# Altium project 001_TL491_3_BMS.PrjPcb
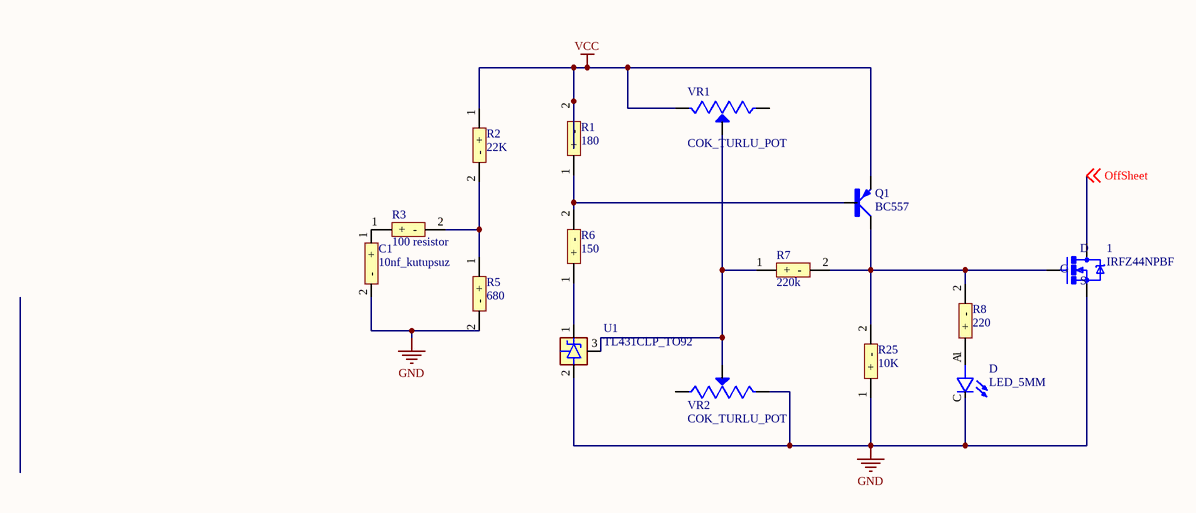
[diagram p0: TL431.SchDoc]
5 sheets, 62 parts. Net scope: global (net labels, ports and power ports of the same name join across sheets).
Board files: PCB1.PcbDoc, 001_20.07.21.PcbDoc, 002_12_08_21.PcbDoc
Sheets:
  TL431.SchDoc
  gerilim_okuma.SchDoc
  hücre_gerilim_okuma.SchDoc
  LM35.SchDoc
  devre.SchDoc

## Sheet TL431.SchDoc
size A4

### Parts
(Parts that share a designator on the sheet are numbered #1, #2 ... from top to bottom, then left to right.)
1  IRFZ44NPBF  [IRFZ44N]
C1  10nf_kutupsuz  [10NF_KUTUPSUZ]
D  LED_5MM  [LED_5MM]
Q1  BC557  [BC557]
R1#1  180  [100 resistor]
R2  22K  [100 resistor]
R3  100 resistor  [100 resistor]
R5  680  [100 resistor]
R6  150  [100 resistor]
R7  220k  [100 resistor]
R8  220  [100 resistor]
R25  10K  [100 resistor]
U1  TL431CLP_TO92  [TL432_TO92]
VR1  COK_TURLU_POT  [COK_TURLU_POT]
VR2  COK_TURLU_POT  [COK_TURLU_POT]

### Nets
GND: 1.3(S) C1.2(-) D.C R5.2(-) R25.1(+) U1.2(ANODE) VR2.3(CW)
VCC: Q1.E R1#1.2(-) R2.1(+) VR1.3(CW)
OffSheet: 1.2(D) ; off-sheet OffSheet
Net1_1: 1.1(G) Q1.C R7.2(-) R8.2(-) R25.2(-)
NetC1_1: C1.1(+) R3.1(+)
NetD_A: D.A R8.1(+)
NetQ1_B: Q1.B R1#1.1(+) R6.2(-)
NetR2_2: R2.2(-) R3.2(-) R5.1(+)
NetR6_1: R6.1(+) U1.1(CATHODE)
NetR7_1: R7.1(+) U1.3(REF) VR1.2(WIPER) VR2.2(WIPER)

Not connected (* = marked no-connect by the designer): VR1 1(CCW); VR2 1(CCW)

### Library data of the parts
1 = IRFZ44NPBF: RoHS Compliant | Low RDS_on_ | Industry-leading quality | Dynamic dv/dt Rating | Fast Switching | Fully Avalanche Rated | 175C Operating Temperature; MF: Infineon; MP: IRFZ44NPBF; Price: None; SnapEDA_Link: https://www.snapeda.com/parts/IRFZ44NPBF/Infineon%20Technologies/view-part/1662576/?ref=snap; Package: TO-220 Infineon; Value: *; Availability: Unavailable
D = LED_5MM: LED; 5mm; green; 5-32mcd; 60Â°; Front: convex; MF: Kingbright; MP: L-53GD; Availability: Unavailable; SnapEDA_Link: https://www.snapeda.com/parts/L-53GD/Kingbright/view-part/525636/?ref=snap; Price: None; Package: CDIP-28 Kingbright; Value: *
Q1 = BC557: Bipolar _BJT_ Transistor PNP 45V 100mA 150MHz 500mW Through Hole TO-92-3; MF: ON; MP: BC557; Price: None; SnapEDA_Link: https://www.snapeda.com/parts/BC557/ON%20Semiconductor/view-part/681642/?ref=snap; Package: TO-92 Rochester Electronics; Value: *; Availability: Unavailable
R1#1 R2 R5-R8 R25 = 100 resistor
U1 = TL431CLP_TO92: Adjustable precision shunt regulator 3-TO-92 0 to 70; MF: Texas Instruments; Purchase-URL: https://pricing.snapeda.com/search/part/TL431CLP/?ref=eda; Price: None; Package: TO-92 Texas Instruments; Check_prices: https://www.snapeda.com/parts/TL431CLP/Texas%20Instruments/view-part/4478972/?ref=eda; Value: *; MP: TL431CLP; Availability: Good; SnapEDA_Link: https://www.snapeda.com/parts/TL431CLP/Texas%20Instruments/view-part/4478972/?ref=snap
VR1 VR2 = COK_TURLU_POT: 30 kOhms 0.5W, 1/2W PC Pins Through Hole Trimmer Potentiometer Cermet 25 Turn Top Adjustment; MP: 3296W-1-303; MF: Bourns; Check_prices: https://www.snapeda.com/parts/3296W-1-303/Bourns/view-part/1485011/?ref=eda; Value: *; Availability: Unavailable; Price: None; Package: SOT-23-5 Bourns; SnapEDA_Link: https://www.snapeda.com/parts/3296W-1-303/Bourns/view-part/1485011/?ref=snap

## Sheet gerilim_okuma.SchDoc
size A4
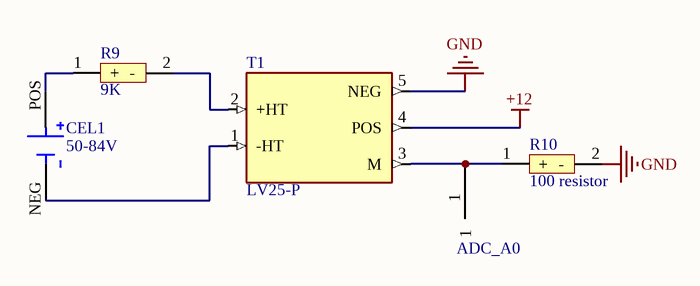
[diagram p1: gerilim_okuma.SchDoc]

### Parts
(Parts that share a designator on the sheet are numbered #1, #2 ... from top to bottom, then left to right.)
CEL1#1  50-84V  [BAT_BA2AAPC-UL94V-0]
P2  ADC_A0  [1pinheader]
R9  9K  [100 resistor]
R10  100 resistor  [100 resistor]
T1  LV25-P  [XDCR_LV25-P]

### Nets
+12: T1.4(POS)
GND: R10.2(-) T1.5(NEG)
NetCEL1#1_NEG: CEL1#1.NEG T1.1(-HT)
NetCEL1#1_POS: CEL1#1.POS R9.1(+)
NetP2_1: P2.1 R10.1(+) T1.3(M)
NetR9_2: R9.2(-) T1.2(+HT)

### Library data of the parts
CEL1#1 = CELL: BATTERY HOLDER AA 2 CELL SMD TAB; MF: MPD; MP: BA2AAPC-UL94V-0; Value: *; Price: None; Package: None; Check_prices: https://www.snapeda.com/parts/BA2AAPC-UL94V-0/MPD/view-part/4389111/?ref=eda; Availability: Warning; SnapEDA_Link: https://www.snapeda.com/parts/BA2AAPC-UL94V-0/MPD/view-part/4389111/?ref=snap; Purchase-URL: https://pricing.snapeda.com/search/part/BA2AAPC-UL94V-0/?ref=eda
P2 = 1 pin header
R9 = 100 resistor
T1 = LV25-P: Voltage, Closed Loop Sensor Voltage Output; MF: LEM USA Inc.; SnapEDA_Link: https://www.snapeda.com/parts/LV%2025-P/LEM%20USA%20Inc./view-part/5138977/?ref=snap; Digi-Key_Part_Number: 398-1019-ND; Value: *; Check_prices: https://www.snapeda.com/parts/LV%2025-P/LEM%20USA%20Inc./view-part/5138977/?ref=eda; MP: LV 25-P; Package: None

## Sheet hücre_gerilim_okuma.SchDoc
size A4
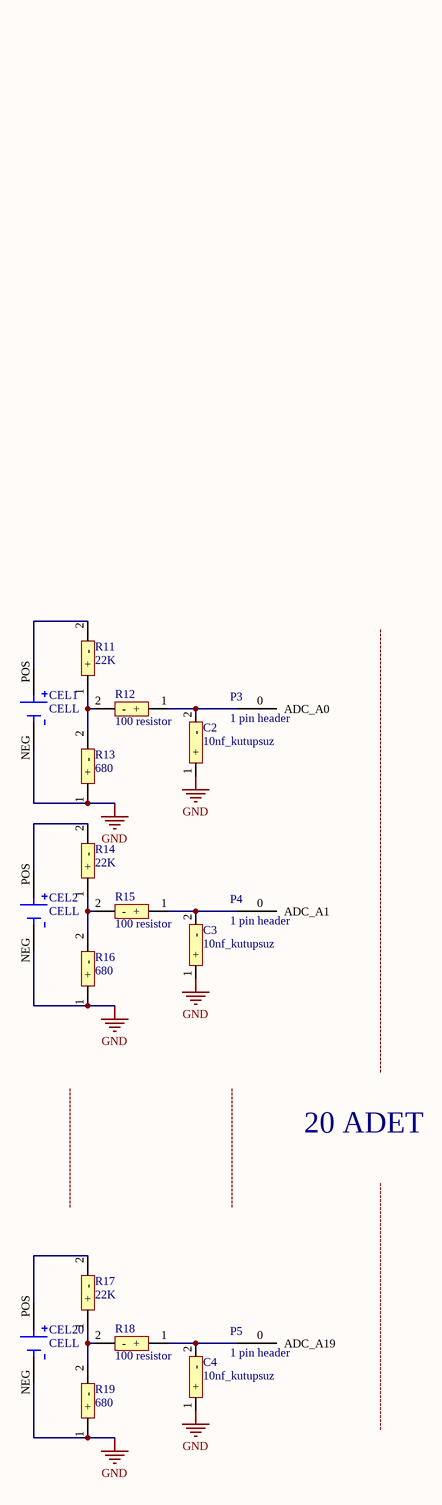
[diagram p2: hücre_gerilim_okuma.SchDoc]

### Parts
(Parts that share a designator on the sheet are numbered #1, #2 ... from top to bottom, then left to right.)
C2  10nf_kutupsuz  [10NF_KUTUPSUZ]
C3  10nf_kutupsuz  [10NF_KUTUPSUZ]
C4  10nf_kutupsuz  [10NF_KUTUPSUZ]
CEL1#2  CELL  [BAT_BA2AAPC-UL94V-0]
CEL2  CELL  [BAT_BA2AAPC-UL94V-0]
CEL20  CELL  [BAT_BA2AAPC-UL94V-0]
P3  1 pin header  [1pinheader]
P4  1 pin header  [1pinheader]
P5  1 pin header  [1pinheader]
R11  22K  [100 resistor]
R12  100 resistor  [100 resistor]
R13  680  [100 resistor]
R14  22K  [100 resistor]
R15  100 resistor  [100 resistor]
R16  680  [100 resistor]
R17  22K  [100 resistor]
R18  100 resistor  [100 resistor]
R19  680  [100 resistor]

### Nets
GND: C2.1(+) C3.1(+) C4.1(+) CEL1#2.NEG CEL2.NEG CEL20.NEG R13.1(+) R16.1(+) R19.1(+)
NetC2_2: C2.2(-) P3.0(ADC_A0) R12.1(+)
NetC3_2: C3.2(-) P4.0(ADC_A1) R15.1(+)
NetC4_2: C4.2(-) P5.0(ADC_A19) R18.1(+)
NetCEL1#2_POS: CEL1#2.POS R11.2(-)
NetCEL2_POS: CEL2.POS R14.2(-)
NetCEL20_POS: CEL20.POS R17.2(-)
NetR11_1: R11.1(+) R12.2(-) R13.2(-)
NetR14_1: R14.1(+) R15.2(-) R16.2(-)
NetR17_1: R17.1(+) R18.2(-) R19.2(-)

### Notes on the sheet
- 20 ADET
- Labels drawn without touching a wire or pin: ------------------------------, --------------------------------------------------------------, ---------------------------------------------------------------------------------------------------------------

### Library data of the parts
CEL1#2 CEL2 CEL20 = CELL: as CEL1#1 on sheet gerilim_okuma; Value: *; Price: None; Package: None; Check_prices: https://www.snapeda.com/parts/BA2AAPC-UL94V-0/MPD/view-part/4389111/?ref=eda; Availability: Warning; SnapEDA_Link: https://www.snapeda.com/parts/BA2AAPC-UL94V-0/MPD/view-part/4389111/?ref=snap; Purchase-URL: https://pricing.snapeda.com/search/part/BA2AAPC-UL94V-0/?ref=eda
R11 R13 R14 R16 R17 R19 = 100 resistor

## Sheet LM35.SchDoc
size A4
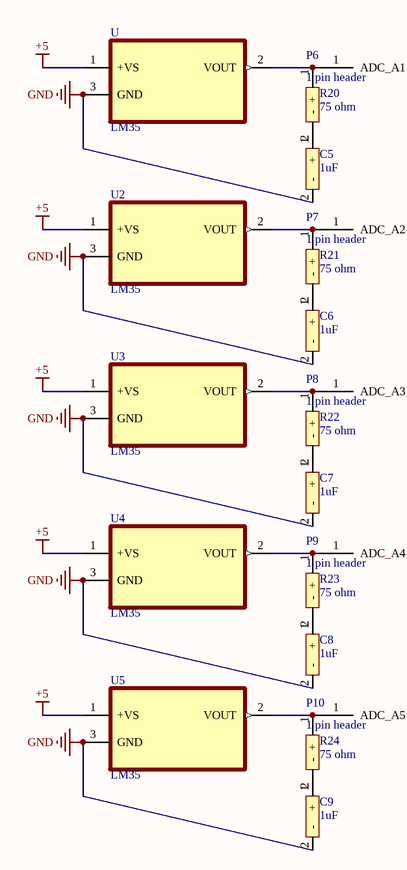
[diagram p3: LM35.SchDoc]

### Parts
C5  1uF  [10NF_KUTUPSUZ]
C6  1uF  [10NF_KUTUPSUZ]
C7  1uF  [10NF_KUTUPSUZ]
C8  1uF  [10NF_KUTUPSUZ]
C9  1uF  [10NF_KUTUPSUZ]
P6  1 pin header  [1pinheader]
P7  1 pin header  [1pinheader]
P8  1 pin header  [1pinheader]
P9  1 pin header  [1pinheader]
P10  1 pin header  [1pinheader]
R20  75 ohm  [100 resistor]
R21  75 ohm  [100 resistor]
R22  75 ohm  [100 resistor]
R23  75 ohm  [100 resistor]
R24  75 ohm  [100 resistor]
U  LM35  [TO127P254X495-3P]
U2  LM35  [TO127P254X495-3P]
U3  LM35  [TO127P254X495-3P]
U4  LM35  [TO127P254X495-3P]
U5  LM35  [TO127P254X495-3P]

### Nets
+5: U.1(+VS) U2.1(+VS) U3.1(+VS) U4.1(+VS) U5.1(+VS)
GND: C5.2(-) C6.2(-) C7.2(-) C8.2(-) C9.2(-) U.3(GND) U2.3(GND) U3.3(GND) U4.3(GND) U5.3(GND)
NetP6_1: P6.1(ADC_A1) R20.1(+) U.2(VOUT)
NetP7_1: P7.1(ADC_A2) R21.1(+) U2.2(VOUT)
NetP8_1: P8.1(ADC_A3) R22.1(+) U3.2(VOUT)
NetP9_1: P9.1(ADC_A4) R23.1(+) U4.2(VOUT)
NetP10_1: P10.1(ADC_A5) R24.1(+) U5.2(VOUT)

Not connected (* = marked no-connect by the designer): C5 1(+); C6 1(+); C7 1(+); C8 1(+); C9 1(+); R20 2(-); R21 2(-); R22 2(-); R23 2(-); R24 2(-)

### Library data of the parts
C5-C9 = 10nf_kutupsuz
R20-R24 = 100 resistor
U U2-U5 = LM35DZ/LFT4: MF: Texas Instruments; Texas_Instruments-Purchase-URL: https://snapeda.com/shop?store=Texas+Instruments&id=19434; Availability: Warning; Mouser-Purchase-URL: https://snapeda.com/shop?store=Mouser&id=19434; Price: None; DigiKey-Purchase-URL: https://snapeda.com/shop?store=DigiKey&id=19434; Package: TO-92-3 Texas Instruments; Value: *; SnapEDA_Link: https://www.snapeda.com/parts/LM35DZ/LFT4/Texas%20Instruments/view-part/19434/?ref=snap; MP: LM35DZ/LFT4; BuyPart: https://www.snapeda.com/parts/LM35DZ/LFT4/Texas%20Instruments/view-part/19434/?ref=eda

## Sheet devre.SchDoc
size A4
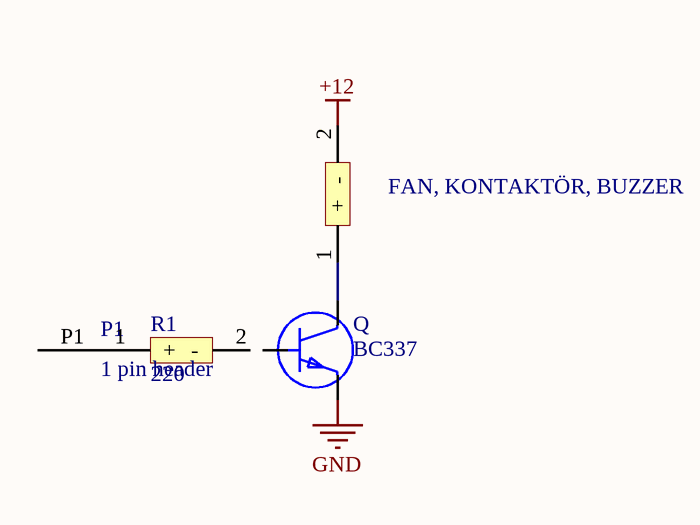
[diagram p4: devre.SchDoc]

### Parts
(Parts that share a designator on the sheet are numbered #1, #2 ... from top to bottom, then left to right.)
FAN,_KONTAKTÖR,_BUZZER  100 resistor  [100 resistor]  (value not drawn)
P1  1 pin header  [1pinheader]
Q  BC337  [TO-92R]
R1#2  220  [100 resistor]

### Nets
+12: FAN,_KONTAKTÖR,_BUZZER.2(-)
GND: Q.1(E)
NetFAN,_KONTAKTÖR,_BUZZER_1: FAN,_KONTAKTÖR,_BUZZER.1(+) Q.3(C)
NetP1_P1: P1.P1 R1#2.1(+)

Not connected (* = marked no-connect by the designer): Q 2(B); R1#2 2(-)

### Library data of the parts
Q = BC337: Bipolar (BJT) Transistor NPN 45V 800mA 100MHz 625mW Through Hole TO-92-3; MF: ON Semiconductor; Availability: Unavailable; Package: TO-92 ON Semiconductor; MP: BC337; SnapEDA_Link: https://www.snapeda.com/parts/BC337/ON%20Semiconductor/view-part/2772334/?ref=snap; Value: *; Price: None
R1#2 = 100 resistor

## Nets that join several sheets
+12: gerilim_okuma (T1.4), devre (FAN,_KONTAKTÖR,_BUZZER.2)
GND: TL431 (7 pins), gerilim_okuma (R10.2 T1.5), hücre_gerilim_okuma (9 pins), LM35 (10 pins), devre (Q.1)